# EasyEDA Pro project ODrive_v1.epro, schematic ODrive2_1

## Sheets
1 Motor: Board Name: ODrive2_1; Create Date: 2025-02-18; Page Name: Motor; Project Name: ODrive; Schematic Name: ODrive2_1; Update Date: 2025-02-18
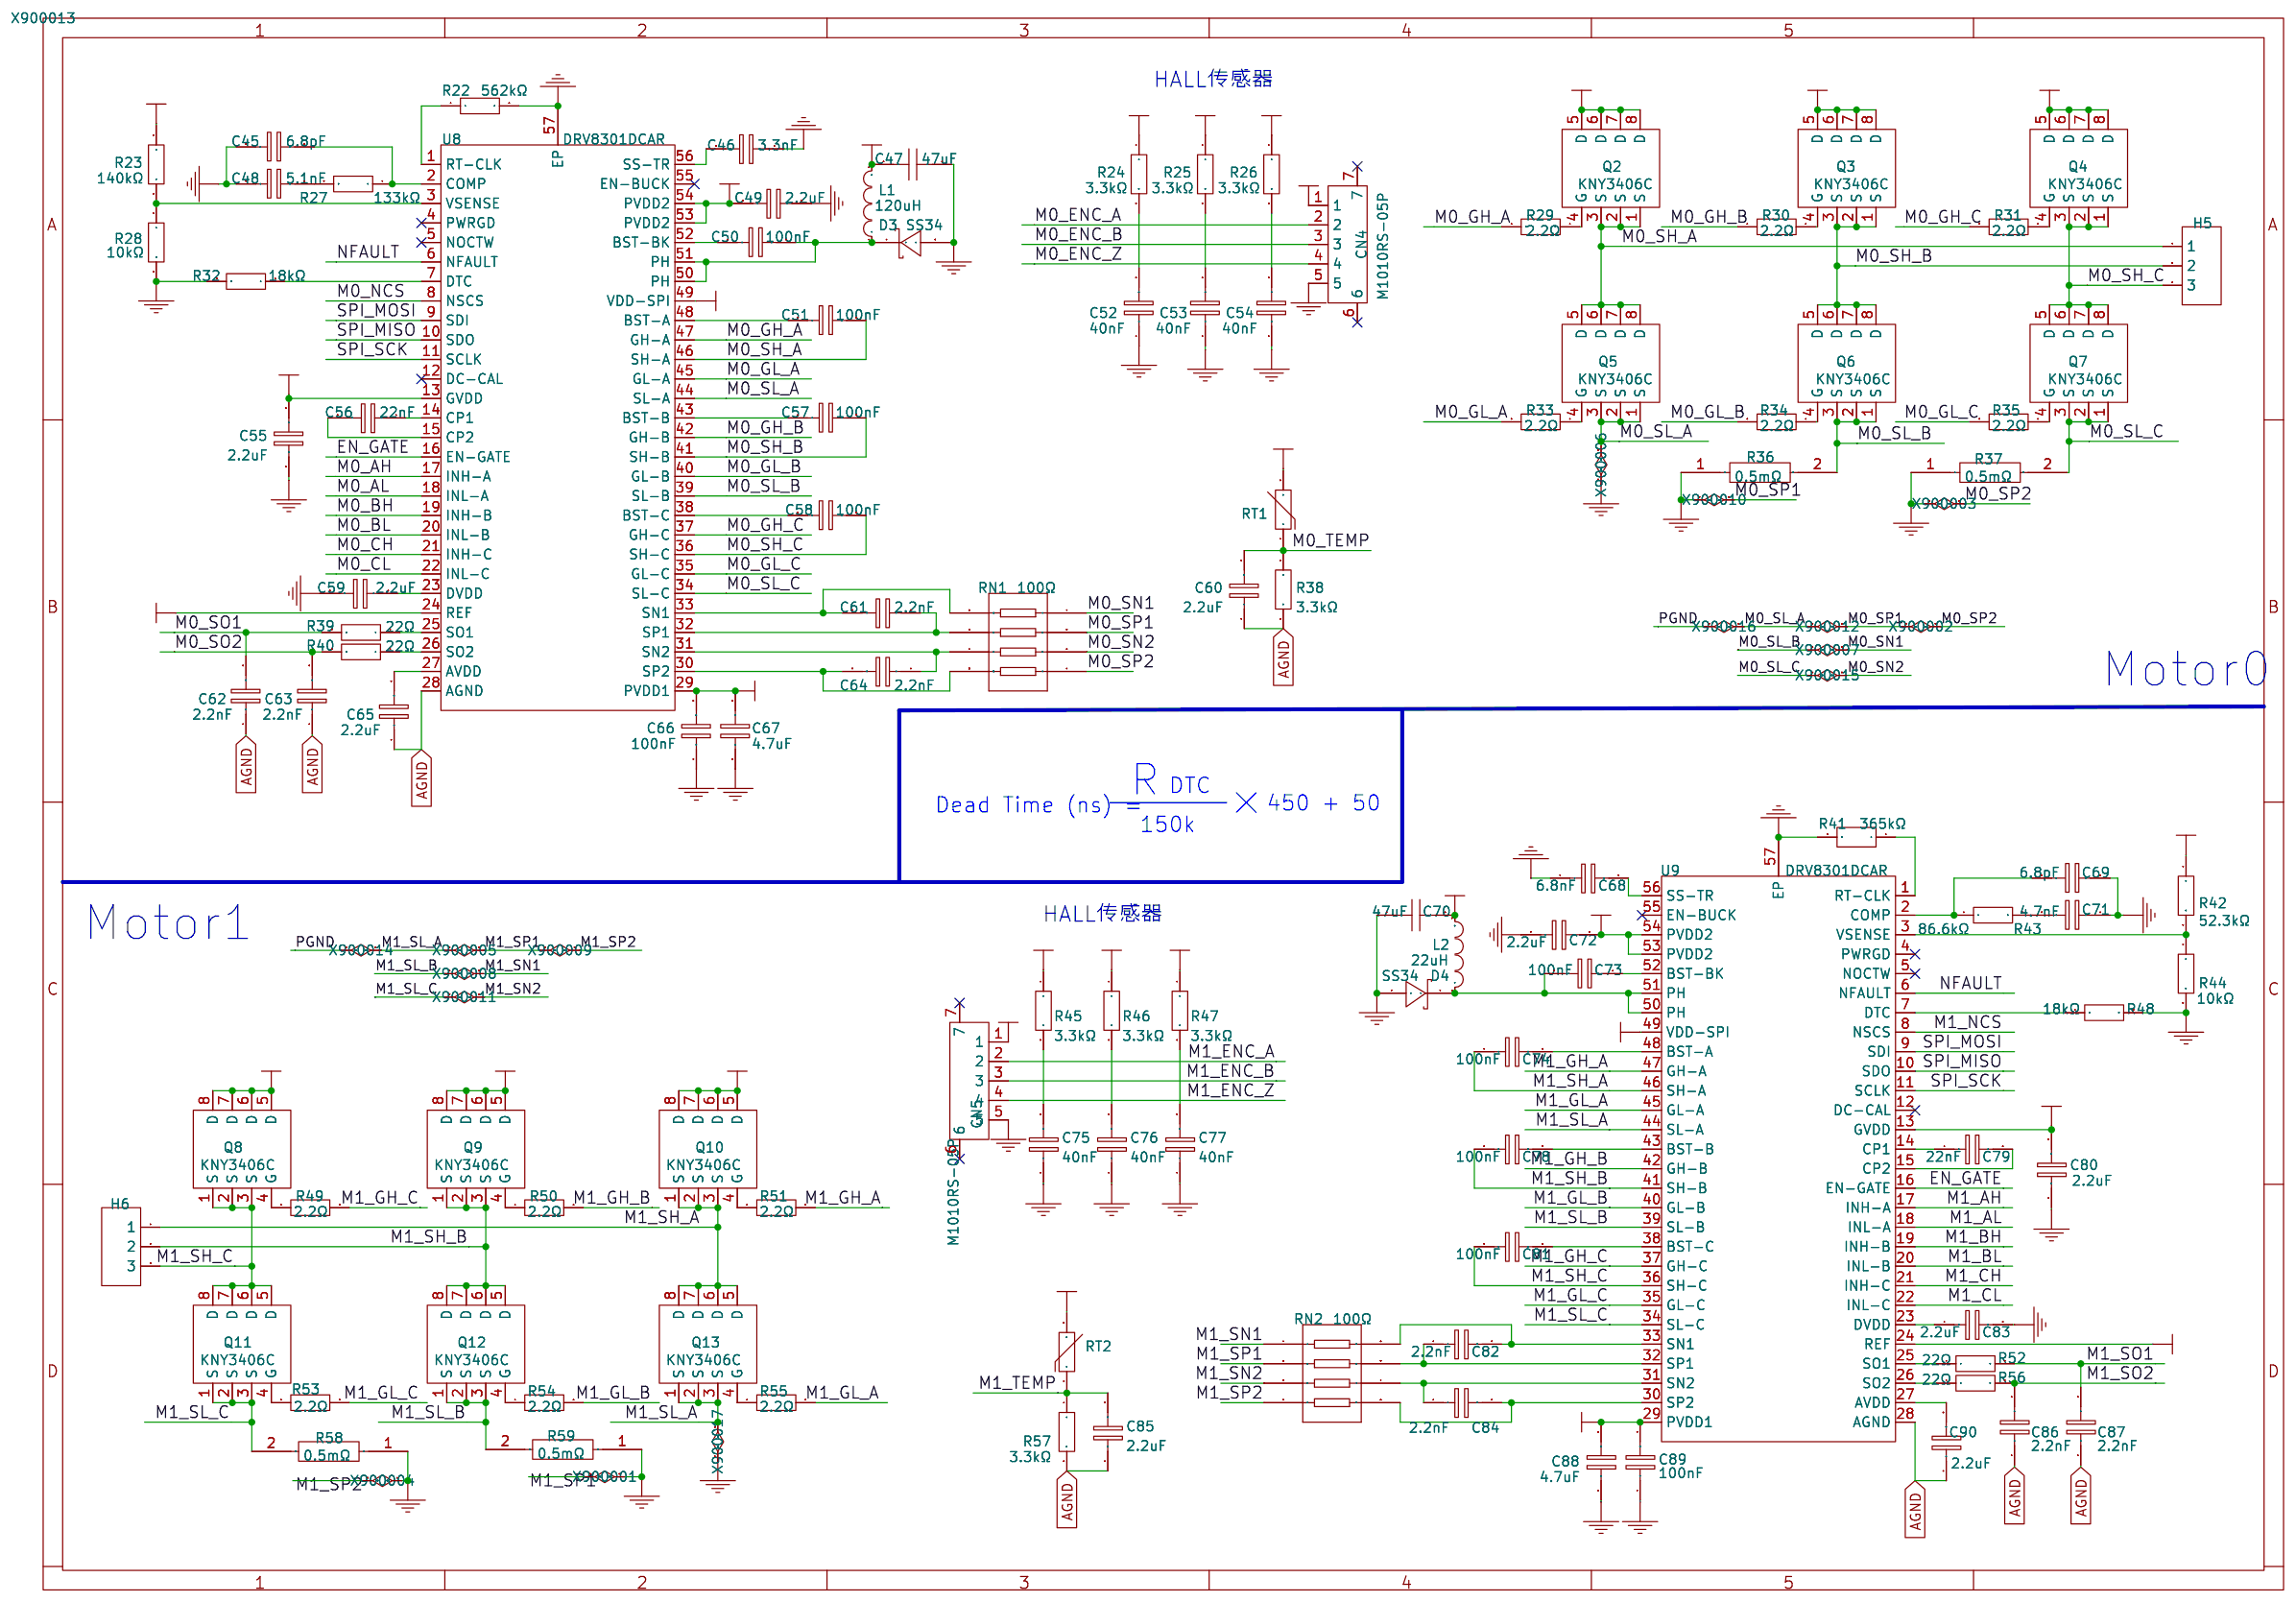
[diagram p5: Motor]
2 Controller: Page Name: Controller; Company: 嘉立创EDA; Page Size: A4; Version: V1.0
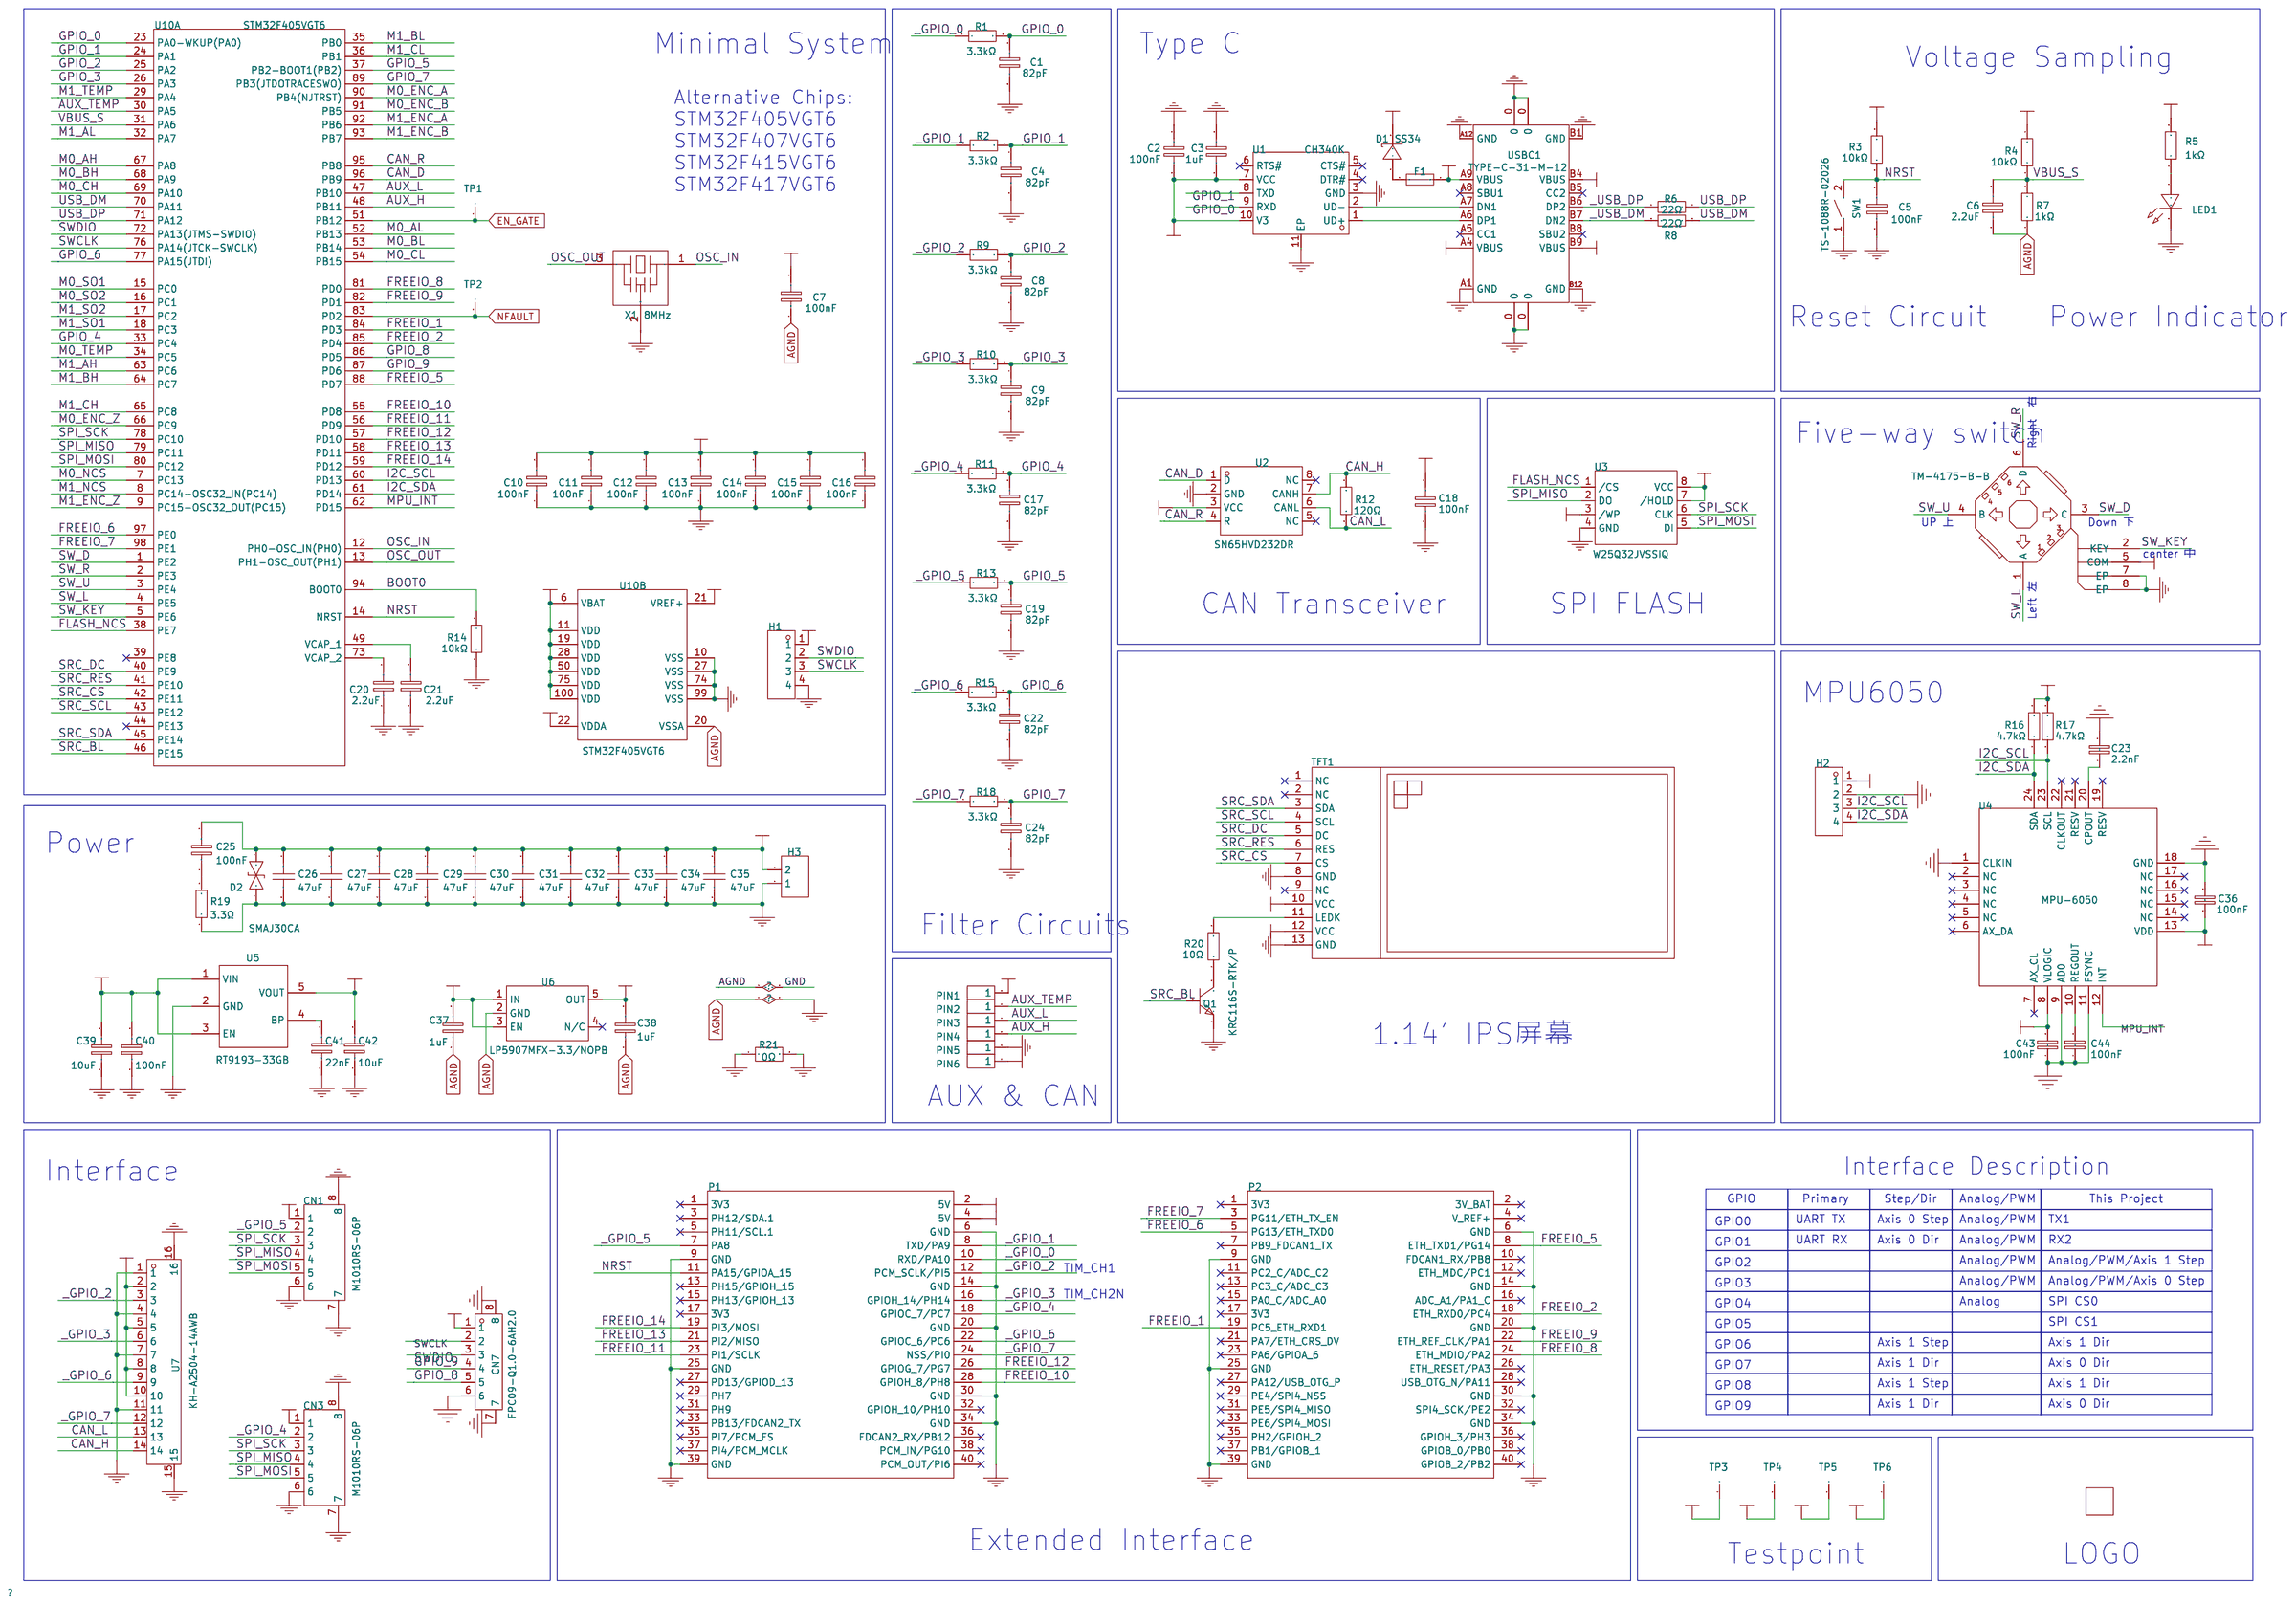
[diagram p6: Controller]

## Parts
sheet Controller
C1  82pF  [C0603]
C2  100nF  [C0603]
C3  1uF  [C0603]
C4  82pF  [C0603]
C5  100nF  [C0603]
C6  2.2uF  [C0603]
C7  100nF  [C0603]
C8  82pF  [C0603]
C9  82pF  [C0603]
C10  100nF  [C0603]
C11  100nF  [C0603]
C12  100nF  [C0603]
C13  100nF  [C0603]
C14  100nF  [C0603]
C15  100nF  [C0603]
C16  100nF  [C0603]
C17  82pF  [C0603]
C18  100nF  [C0603]
C19  82pF  [C0603]
C20  2.2uF  [C0603]
C21  2.2uF  [C0603]
C22  82pF  [C0603]
C23  2.2nF  [C0603]
C24  82pF  [C0603]
C25  100nF  [C0603]
C26  47uF  [C1812]
C27  47uF  [C1812]
C28  47uF  [C1812]
C29  47uF  [C1812]
C30  47uF  [C1812]
C31  47uF  [C1812]
C32  47uF  [C1812]
C33  47uF  [C1812]
C34  47uF  [C1812]
C35  47uF  [C1812]
C36  100nF  [C0603]
C37  1uF  [C0603]
C38  1uF  [C0603]
C39  10uF  [C0603]
C40  100nF  [C0603]
C41  22nF  [C0603]
C42  10uF  [C0603]
C43  100nF  [C0603]
C44  100nF  [C0603]
CN1  M1010RS-06P  [CONN-SMD_M1010RS-06P]
CN3  M1010RS-06P  [CONN-SMD_M1010RS-06P]
CN7  FPC09-Q1.0-6AH2.0  [FPC-SMD_6P-P1.00_XYECONN_FPC09-Q1.0-6AH2.0]
D1  SS34  [SMA_L4.4-W2.8-LS5.4-RD]
D2  SMAJ30CA  [SMA_L4.4-W2.6-LS5.0-BI]
F1  FSMD012-1206-R  [F1206]
H1  -  [HDR-TH_4P-P2.54-V-M]
H2  -  [HDR-TH_4P-P2.54-V-M]
H3  XT30U-M  [XT30U-M]
H4  MoonGrt  [MoonGrt]  (no BOM)
LED1  YLED0603B  [LED0603_BLUE]
P1  2.54-2*20P母  [MY_HDR-TH_40P-P2.54-V-M-R2-C20-S2.54]
P2  2.54-2*20P母  [MY_HDR-TH_40P-P2.54-V-M-R2-C20-S2.54]
PIN1  1PIN  [1PIN]  (no BOM)
PIN2  1PIN  [1PIN]  (no BOM)
PIN3  1PIN  [1PIN]  (no BOM)
PIN4  1PIN  [1PIN]  (no BOM)
PIN5  1PIN  [1PIN]  (no BOM)
PIN6  1PIN  [1PIN]  (no BOM)
Q1  KRC116S-RTK/P  [SOT-23-3_L2.9-W1.6-P1.90-LS2.8-BR]
R1  3.3kΩ  [R0603]
R2  3.3kΩ  [R0603]
R3  10kΩ  [R0603]
R4  10kΩ  [R0603]
R5  1kΩ  [R0603]
R6  22Ω  [R0603]
R7  1kΩ  [R0603]
R8  22Ω  [R0603]
R9  3.3kΩ  [R0603]
R10  3.3kΩ  [R0603]
R11  3.3kΩ  [R0603]
R12  120Ω  [R0603]
R13  3.3kΩ  [R0603]
R14  10kΩ  [R0603]
R15  3.3kΩ  [R0603]
R16  4.7kΩ  [R0603]
R17  4.7kΩ  [R0603]
R18  3.3kΩ  [R0603]
R19  3.3Ω  [R0603]
R20  10Ω  [R0603]
R21  0Ω  [R0603]
SW1  TS-1088R-02026  [SW-SMD_L3.9-W3.0-P4.45]
SW2  TM-4175-B-B  [SW-SMD_TM-4175-B-B]
TFT1  焊接式_TFT_1.14_135x240_13pin  [焊接式_TFT_1.14_135X240_13PIN]
TP1  Testpoint 1.6mm  [TESTPOINT 1.6MM]  (no BOM)
TP2  Testpoint 1.6mm  [TESTPOINT 1.6MM]  (no BOM)
TP3  Testpoint 1.6mm  [TESTPOINT 1.6MM]  (no BOM)
TP4  Testpoint 1.6mm  [TESTPOINT 1.6MM]  (no BOM)
TP5  Testpoint 1.6mm  [TESTPOINT 1.6MM]  (no BOM)
TP6  Testpoint 1.6mm  [TESTPOINT 1.6MM]  (no BOM)
U1  CH340K  [ESOP-10_L4.9-W3.9-P1.00-LS6.2-BL-EP]
U2  SN65HVD232DR  [SOIC-8_L5.0-W4.0-P1.27-LS6.0-BL]
U3  W25Q32JVSSIQ  [SOIC-8_L5.3-W5.3-P1.27-LS8.0-BL]
U4  MPU-6050  [QFN-24_L4.0-W4.0-P0.50-BL-EP2.7]
U5  RT9193-33GB  [SOT-23-5_L3.0-W1.7-P0.95-LS2.8-BR]
U6  LP5907MFX-3.3/NOPB  [SOT-23-5_L3.0-W1.7-P0.95-LS2.8-BR]
U7  KH-A2504-14AWB  [CONN-SMD_14P-P2.50_KH-A2504-14AWB]
U10  STM32F405VGT6  [LQFP-100_L14.0-W14.0-P0.50-LS16.0-BL]  (sections 1,2)
USBC1  TYPE-C-31-M-12  [USB-C_SMD-TYPE-C-31-M-12]
X1  8MHz  [OSC-SMD_3P-L3.2-W1.3-P1.20]
sheet Motor
C45  6.8pF  [C0603]
C46  3.3nF  [C0603]
C47  47uF  [C1812]
C48  5.1nF  [C0603]
C49  2.2uF  [C0603]
C50  100nF  [C0603]
C51  100nF  [C0603]
C52  40nF  [C0603]
C53  40nF  [C0603]
C54  40nF  [C0603]
C55  2.2uF  [C0603]
C56  22nF  [C0603]
C57  100nF  [C0603]
C58  100nF  [C0603]
C59  2.2uF  [C0603]
C60  2.2uF  [C0603]
C61  2.2nF  [C0603]
C62  2.2nF  [C0603]
C63  2.2nF  [C0603]
C64  2.2nF  [C0603]
C65  2.2uF  [C0603]
C66  100nF  [C0603]
C67  4.7uF  [C0603]
C68  6.8nF  [C0603]
C69  6.8pF  [C0603]
C70  47uF  [C1812]
C71  4.7nF  [C0603]
C72  2.2uF  [C0603]
C73  100nF  [C0603]
C74  100nF  [C0603]
C75  40nF  [C0603]
C76  40nF  [C0603]
C77  40nF  [C0603]
C78  100nF  [C0603]
C79  22nF  [C0603]
C80  2.2uF  [C0603]
C81  100nF  [C0603]
C82  2.2nF  [C0603]
C83  2.2uF  [C0603]
C84  2.2nF  [C0603]
C85  2.2uF  [C0603]
C86  2.2nF  [C0603]
C87  2.2nF  [C0603]
C88  4.7uF  [C0603]
C89  100nF  [C0603]
C90  2.2uF  [C0603]
CN4  M1010RS-05P  [CONN-SMD_M1010RS-05P]
CN5  M1010RS-05P  [CONN-SMD_M1010RS-05P]
D3  SS34  [SMA_L4.4-W2.8-LS5.4-RD]
D4  SS34  [SMA_L4.4-W2.8-LS5.4-RD]
H5  MR30-M  [MR30-M]
H6  MR30-M  [MR30-M]
L1  120uH  [IND-SMD_L6.0-W6.0]
L2  22uH  [IND-SMD_L6.0-W6.0]
Q2  KNY3406C  [PDFNWB-8L_L6.0-W5.0-P1.27-BL-EP_CON]
Q3  KNY3406C  [PDFNWB-8L_L6.0-W5.0-P1.27-BL-EP_CON]
Q4  KNY3406C  [PDFNWB-8L_L6.0-W5.0-P1.27-BL-EP_CON]
Q5  KNY3406C  [PDFNWB-8L_L6.0-W5.0-P1.27-BL-EP_CON]
Q6  KNY3406C  [PDFNWB-8L_L6.0-W5.0-P1.27-BL-EP_CON]
Q7  KNY3406C  [PDFNWB-8L_L6.0-W5.0-P1.27-BL-EP_CON]
Q8  KNY3406C  [PDFNWB-8L_L6.0-W5.0-P1.27-BL-EP_CON]
Q9  KNY3406C  [PDFNWB-8L_L6.0-W5.0-P1.27-BL-EP_CON]
Q10  KNY3406C  [PDFNWB-8L_L6.0-W5.0-P1.27-BL-EP_CON]
Q11  KNY3406C  [PDFNWB-8L_L6.0-W5.0-P1.27-BL-EP_CON]
Q12  KNY3406C  [PDFNWB-8L_L6.0-W5.0-P1.27-BL-EP_CON]
Q13  KNY3406C  [PDFNWB-8L_L6.0-W5.0-P1.27-BL-EP_CON]
R22  562kΩ  [R0603]
R23  140kΩ  [R0603]
R24  3.3kΩ  [R0603]
R25  3.3kΩ  [R0603]
R26  3.3kΩ  [R0603]
R27  133kΩ  [R0603]
R28  10kΩ  [R0603]
R29  2.2Ω  [R0603]
R30  2.2Ω  [R0603]
R31  2.2Ω  [R0603]
R32  18kΩ  [R0603]
R33  2.2Ω  [R0603]
R34  2.2Ω  [R0603]
R35  2.2Ω  [R0603]
R36  0.5mΩ  [R2512]
R37  0.5mΩ  [R2512]
R38  3.3kΩ  [R0603]
R39  22Ω  [R0603]
R40  22Ω  [R0603]
R41  365kΩ  [R0603]
R42  52.3kΩ  [R0603]
R43  86.6kΩ  [R0603]
R44  10kΩ  [R0603]
R45  3.3kΩ  [R0603]
R46  3.3kΩ  [R0603]
R47  3.3kΩ  [R0603]
R48  18kΩ  [R0603]
R49  2.2Ω  [R0603]
R50  2.2Ω  [R0603]
R51  2.2Ω  [R0603]
R52  22Ω  [R0603]
R53  2.2Ω  [R0603]
R54  2.2Ω  [R0603]
R55  2.2Ω  [R0603]
R56  22Ω  [R0603]
R57  3.3kΩ  [R0603]
R58  0.5mΩ  [R2512]
R59  0.5mΩ  [R2512]
RN1  100Ω  [RES-ARRAY-SMD_0603-8P-L3.2-W1.6-BL]
RN2  100Ω  [RES-ARRAY-SMD_0603-8P-L3.2-W1.6-BL]
RT1  NCP18XH103F03RB  [R0603]
RT2  NCP18XH103F03RB  [R0603]
U8  DRV8301DCAR  [HTSSOP-56_L14.0-W6.0-P0.50-LS8.0-BL]
U9  DRV8301DCAR  [HTSSOP-56_L14.0-W6.0-P0.50-LS8.0-BL]

## Library data of the parts
C1 C4 C8 C9 C17 C19 C22 C24 = 0603CG820J500NT: 容值:82pF;精度:±5%;额定电压:50V;材质(温度系数):C0G;; LCSC Part Name: 82pF ±5% 50V; Supplier Part: C1683; Manufacturer: FH(风华); Supplier Footprint: 0603; JLCPCB Part Class: Extended Part; Datasheet: https://atta.szlcsc.com/upload/public/pdf/source/20200305/C486355_26A10D38EF8C2A5C37091D0039909270.pdf; Supplier: LCSC; Tolerance: ±5%; Voltage Rated: 50V; Temperature Coefficient: C0G
C2 C5 C7 C10-C16 C18 C25 C36 C40 C43 C44 C50 C51 C57 C58 C66 C73 C74 C78 C81 C89 = CC0603KRX7R9BB104: 容值:100nF;精度:±10%;额定电压:50V;材质(温度系数):X7R;; LCSC Part Name: 100nF ±10% 50V; Supplier Part: C14663; Manufacturer: YAGEO(国巨); Supplier Footprint: 0603; JLCPCB Part Class: Basic Part; Datasheet: https://atta.szlcsc.com/upload/public/pdf/source/20180910/C282072_33301C7F631E79921B82A8DAC6BCC5B3.pdf; Supplier: LCSC; Tolerance: ±10%; Voltage Rated: 50V; Temperature Coefficient: X7R
C3 C37 C38 = CL10A105KO8NNNC: 容值:1uF;精度:±10%;额定电压:16V;材质(温度系数):X5R;; LCSC Part Name: 1uF ±10% 16V; Supplier Part: C1592; Manufacturer: SAMSUNG(三星); Supplier Footprint: 0603; JLCPCB Part Class: Extended Part; Datasheet: https://atta.szlcsc.com/upload/public/pdf/source/20220919/9FBE606BE0D9532D730F292EB26DC5BB.pdf; Supplier: LCSC; Tolerance: ±10%; Voltage Rated: 16V; Temperature Coefficient: X5R
C6 C20 C21 C49 C55 C59 C60 C65 C72 C80 C83 C85 C90 = GRM188R61H225KE11D: 容值:2.2uF;精度:±10%;额定电压:50V;材质(温度系数):X5R;; LCSC Part Name: 2.2uF ±10% 50V; Supplier Part: C162273; Manufacturer: muRata(村田); Supplier Footprint: 0603; JLCPCB Part Class: Extended Part; Datasheet: https://atta.szlcsc.com/upload/public/pdf/source/20181211/C162273_A9C6FF7829784AEF50225F4680DD9126.pdf; Supplier: LCSC; Tolerance: ±10%; Voltage Rated: 50V; Temperature Coefficient: X5R
C23 C61-C64 C82 C84 C86 C87 = 0603B222K500NT: 容值:2.2nF;精度:±10%;额定电压:50V;材质(温度系数):X7R;; LCSC Part Name: 2.2nF ±10% 50V; Supplier Part: C1604; Manufacturer: FH(风华); Supplier Footprint: 0603; JLCPCB Part Class: Basic Part; Datasheet: https://atta.szlcsc.com/upload/public/pdf/source/20200305/C486355_26A10D38EF8C2A5C37091D0039909270.pdf; Supplier: LCSC; Tolerance: ±10%; Voltage Rated: 50V; Temperature Coefficient: X7R
C26-C35 C47 C70 = C4532X5R1A476MT000N: 容值:47uF;精度:±20%;额定电压:10V;材质(温度系数):X5R;; LCSC Part Name: 47uF ±20% 10V; Supplier Part: C342615; Manufacturer: TDK; Supplier Footprint: 1812; JLCPCB Part Class: Extended Part; Datasheet: https://atta.szlcsc.com/upload/public/pdf/source/20190612/C361180_85CC9FB0751BEA97238DE56AB4AF0B1F.pdf; Supplier: LCSC; Tolerance: ±20%; Voltage Rated: 10V; Temperature Coefficient: X5R
C39 C42 = CL10A106MP8NNNC: 容值:10uF;精度:±20%;额定电压:10V;材质(温度系数):X5R;; LCSC Part Name: 10uF ±20% 10V; Supplier Part: C85713; Manufacturer: SAMSUNG(三星); Supplier Footprint: 0603; JLCPCB Part Class: Extended Part; Datasheet: https://atta.szlcsc.com/upload/public/pdf/source/20160218/1457707763339.pdf; Supplier: LCSC; Tolerance: ±20%; Voltage Rated: 10V; Temperature Coefficient: X5R
C41 C56 C79 = CL10B223KB8NNNC: 容值:22nF;精度:±10%;额定电压:50V;材质(温度系数):X7R;; LCSC Part Name: 22nF ±10% 50V; Supplier Part: C21122; Manufacturer: SAMSUNG(三星); Supplier Footprint: 0603; JLCPCB Part Class: Basic Part; Datasheet: https://atta.szlcsc.com/upload/public/pdf/source/20160218/1457707763339.pdf; Supplier: LCSC; Tolerance: ±10%; Voltage Rated: 50V; Temperature Coefficient: X7R
CN1 CN3 = M1010RS-06P: 插针结构:1x6P;间距:1mm;安装方式:卧贴;参考系列:-;总PIN数:6P;排数:1;每排PIN数:6;行距:-;额定电流:1A;工作温度范围:-25℃~+85℃;; LCSC Part Name: 1x6P 间距:1mm 卧贴; Supplier Part: C541848; Manufacturer: XFCN(兴飞); Supplier Footprint: SMD,P=1mm,卧贴; JLCPCB Part Class: Extended Part; Datasheet: https://atta.szlcsc.com/upload/public/pdf/source/20200518/C541847_4FBBB7CE1CCFE042AF6DD43CBAA42E89.pdf; Supplier: LCSC; Pins Structure: 1x6P; Pitch: 1mm; Mounting Style: 卧贴; Number of Pins: 6P; Number of Rows: 1; Number of PINs Per Row: 6; Current Rating (Max): 1A; Operating Temperature Range: -25℃~+85℃
CN7 = FPC09-Q1.0-6AH2.0: 锁定特性:翻盖式;触点类型:下接;触点数量:6P;间距:1mm;安装类型:卧贴;; LCSC Part Name: 间距:1mm P数:6P 翻盖式 下接; Supplier Part: C19269921; Manufacturer: XYECONN(辛译); Supplier Footprint: SMD,P=1mm,卧贴; JLCPCB Part Class: Extended Part; Datasheet: https://atta.szlcsc.com/upload/public/pdf/source/20231122/290E50ABEF878A57FE1C34FD27D651A8.pdf; Supplier: LCSC; Locking Feature: 翻盖式; Contact Type: 下接; Number of Contacts: 6P; Pitch: 1mm; Mounting Type: 卧贴; Height Above Board: 2mm
D1 D3 D4 = SS34_C142458: 正向压降(Vf):500mV@3A;直流反向耐压(Vr):40V;平均整流电流(Io):3A;; LCSC Part Name: 电压:40V 电流:3A; Supplier Part: C142458; Supplier Footprint: SMA(DO-214AC); JLCPCB Part Class: Extended Part; Datasheet: https://atta.szlcsc.com/upload/public/pdf/source/20171114/C142458_15106326937931117548.pdf; Supplier: LCSC; Forward Voltage (Vf@If): 500mV@3A; Reverse Voltage (Vr): 40V; Average Rectified Current (Io): 3A
D2 = SMAJ30CA_C266339: 反向截止电压(Vrwm):30V;最大钳位电压:48.4V;峰值脉冲电流(Ipp):8.3A;峰值脉冲功率(Ppp):400W;击穿电压:33.3V;; LCSC Part Name: 双向TVS 30V截止 8.3A峰值脉冲; Supplier Part: C266339; Manufacturer: GOOD-ARK(固锝); Supplier Footprint: SMA(DO-214AC); JLCPCB Part Class: Extended Part; Datasheet: https://atta.szlcsc.com/upload/public/pdf/source/20181218/C266339_E2F84BC65B90D6C192327DA52037B2A6.pdf; Supplier: LCSC; Reverse Stand-Off Voltage (Vrwm): 30V; Maximum Clamping Voltage: 48.4V; Peak Pulse Current (Ipp): 8.3A; Peak Pulse Power Dissipation (Ppp): 400W; Breakdown Voltage: 33.3V; Reverse Leakage Current (Ir): 1uA; Type: TVS
F1 = FSMD012-1206-R: 最大电压:48V;最大电流:100A;保持电流:120mA;跳闸电流:390mA;; LCSC Part Name: 48V 120mA 1206自恢复; Supplier Part: C220144; Manufacturer: FUZETEC(富致); Supplier Footprint: 1206; JLCPCB Part Class: Extended Part; Datasheet: https://atta.szlcsc.com/upload/public/pdf/source/20180530/C220148_049DD1B3B45E5B13B513EB60E97CECB8.pdf; Supplier: LCSC; Operating Voltage (Max): 48V; Current Rating (Max): 100A; Hold Current: 120mA; Trip Current: 390mA
H1 H2 = PZ254V-11-04P: Supplier Part: C2691448
H3 = XT30U-M: Supplier Part: C99101; Supplier: LCSC; Manufacturer: AMASS(艾迈斯)
H4 = MoonGrt
LED1 = YLED0603B: 发光颜色:蓝色;正向电压(VF):2.6V~3.2V;功率:-;正向电流:30mA;主波长:460nm~475nm;发光角度:120°;工作温度:-40℃~+85℃;; Supplier Part: C19171394; Manufacturer: YONGYUTAI(永裕泰); Supplier Footprint: 0603; JLCPCB Part Class: Extended Part; Datasheet: https://atta.szlcsc.com/upload/public/pdf/source/20231027/6134FF4BA718E32A802654BBC76F69A6.pdf; Supplier: LCSC; Emitted Color: 蓝色; Forward Voltage (VF): 2.6V~3.2V; Forward Current: 30mA; Dominant Wavelength: 460nm~475nm; Viewing Angle: 120°; Operating Temperature: -40℃~+85℃
P1 P2 = 2.54-2*20P母: 插孔结构:2x20P;间距:2.54mm;行距:2.54mm;安装类型:直插;排数:双排;总孔位数:40P;塑高:-;触头材质:黄铜;触头镀层:-;; LCSC Part Name: 间距:2.54mm 2x20P 直插; Supplier Part: C50982; Manufacturer: BOOMELE(博穆精密); Supplier Footprint: 插件,P=2.54mm; JLCPCB Part Class: Extended Part; Supplier: LCSC; Holes Structure: 2x20P; Pitch: 2.54mm; Row Spacing: 2.54mm; Mounting Type: 直插; Number of Rows: 双排; Number of Holes: 40P; Contact Material: 黄铜
PIN1-PIN6 = 1PIN
Q1 = KRC116S-RTK/P: 晶体管类型:-;集射极击穿电压(Vceo):50V;集电极电流(Ic):100mA;功率(Pd):200mW;; LCSC Part Name: 耐压:50V 电流:100mA; Supplier Part: C125283; Manufacturer: KEC; Supplier Footprint: SOT-23; JLCPCB Part Class: Extended Part; Datasheet: https://atta.szlcsc.com/upload/public/pdf/source/20170814/C125285_1502678179881885598.pdf; Supplier: LCSC; Collector-Emitter Breakdown Voltage (Vceo): 50V; Collector Current (Ic): 100mA; Power Dissipation (Pd): 200mW
R1 R2 R9-R11 R13 R15 R18 R24-R26 R38 R45-R47 R57 = 0603WAF3301T5E: 电阻类型:厚膜电阻;阻值:3.3kΩ;精度:±1%;功率:100mW;最大工作电压:75V;温度系数:±100ppm/℃;; LCSC Part Name: 3.3kΩ ±1% 100mW 厚膜电阻; Supplier Part: C22978; Manufacturer: UNI-ROYAL(厚声); Supplier Footprint: 0603; JLCPCB Part Class: Basic Part; Datasheet: https://atta.szlcsc.com/upload/public/pdf/source/20200306/C422600_1E6D84923E4A46A82E41ADD87F860B5C.pdf; Supplier: LCSC; Type: 厚膜电阻; Tolerance: ±1%; Power(Watts): 100mW; Overload Voltage (Max): 75V; Temperature Coefficient: ±100ppm/℃; Operating Temperature Range: -55℃~+155℃
R3 R4 R14 R28 R44 = RC0603FR-0710KL: 电阻类型:厚膜电阻;阻值:10kΩ;精度:±1%;功率:100mW;最大工作电压:75V;温度系数:±100ppm/℃;; LCSC Part Name: 厚膜电阻 10kΩ ±1% 100mW; Supplier Part: C98220; Manufacturer: YAGEO(国巨); Supplier Footprint: 0603; JLCPCB Part Class: Extended Part; Datasheet: https://atta.szlcsc.com/upload/public/pdf/source/20180927/C295883_E8D83085EA81BD7DE0B2B681138C15EE.pdf; Supplier: LCSC; Type: 厚膜电阻; Tolerance: ±1%; Power(Watts): 100mW; Overload Voltage (Max): 75V; Temperature Coefficient: ±100ppm/℃; Operating Temperature Range: -55℃~+155℃
R5 R7 = RT0603FRE071KL: 电阻类型:薄膜电阻;阻值:1kΩ;精度:±1%;功率:100mW;最大工作电压:75V;温度系数:±50ppm/℃;; LCSC Part Name: 薄膜电阻 1kΩ ±1% 100mW; Supplier Part: C375503; Manufacturer: YAGEO(国巨); Supplier Footprint: 0603; JLCPCB Part Class: Extended Part; Datasheet: https://atta.szlcsc.com/upload/public/pdf/source/20190227/C375503_9EB26A65C07F9B8645B441605E668894.pdf; Supplier: LCSC; Type: 薄膜电阻; Tolerance: ±1%; Power(Watts): 100mW; Overload Voltage (Max): 75V; Temperature Coefficient: ±50ppm/℃; Operating Temperature Range: -55℃~+155℃
R6 R8 R39 R40 R52 R56 = ARG03FTC0220: 电阻类型:薄膜电阻;阻值:22Ω;精度:±1%;功率:100mW;最大工作电压:75V;温度系数:±25ppm/℃;; LCSC Part Name: 薄膜电阻 22Ω ±1% 100mW; Supplier Part: C217888; Manufacturer: Viking(光颉); Supplier Footprint: 0603; JLCPCB Part Class: Extended Part; Datasheet: https://atta.szlcsc.com/upload/public/pdf/source/20200117/C485675_99063924B4564AF910B7BE66DA8EFA49.pdf; Supplier: LCSC; Type: 薄膜电阻; Tolerance: ±1%; Power(Watts): 100mW; Overload Voltage (Max): 75V; Temperature Coefficient: ±25ppm/℃; Operating Temperature Range: -55℃~+155℃
R12 = HPCR0603F120RK9: 电阻类型:厚膜电阻;阻值:120Ω;精度:±1%;功率:-;最大工作电压:50V;温度系数:±100ppm/℃;; LCSC Part Name: 厚膜电阻 120Ω ±1%; Supplier Part: C365072; Manufacturer: RESI(开步睿思); Supplier Footprint: 0603; JLCPCB Part Class: Extended Part; Datasheet: https://atta.szlcsc.com/upload/public/pdf/source/20200302/C492020_A67DFE56E3A0098A28FA0495227278A6.pdf; Supplier: LCSC; Type: 厚膜电阻; Tolerance: ±1%; Overload Voltage (Max): 50V; Temperature Coefficient: ±100ppm/℃; Operating Temperature Range: -55℃~+125℃
R16 R17 = 0603WAF4701T5E: 电阻类型:厚膜电阻;阻值:4.7kΩ;精度:±1%;功率:100mW;最大工作电压:75V;温度系数:±100ppm/℃;; LCSC Part Name: 4.7kΩ ±1% 100mW 厚膜电阻; Supplier Part: C23162; Manufacturer: UNI-ROYAL(厚声); Supplier Footprint: 0603; JLCPCB Part Class: Basic Part; Datasheet: https://atta.szlcsc.com/upload/public/pdf/source/20200306/C422600_1E6D84923E4A46A82E41ADD87F860B5C.pdf; Supplier: LCSC; Type: 厚膜电阻; Tolerance: ±1%; Power(Watts): 100mW; Overload Voltage (Max): 75V; Temperature Coefficient: ±100ppm/℃; Operating Temperature Range: -55℃~+155℃
R19 = 0603WAF330KT5E: 电阻类型:厚膜电阻;阻值:3.3Ω;精度:±1%;功率:100mW;最大工作电压:75V;温度系数:±400ppm/℃;; LCSC Part Name: 3.3Ω ±1% 100mW 厚膜电阻; Supplier Part: C22979; Manufacturer: UNI-ROYAL(厚声); Supplier Footprint: 0603; JLCPCB Part Class: Extended Part; Datasheet: https://atta.szlcsc.com/upload/public/pdf/source/20200306/C422600_1E6D84923E4A46A82E41ADD87F860B5C.pdf; Supplier: LCSC; Type: 厚膜电阻; Tolerance: ±1%; Power(Watts): 100mW; Overload Voltage (Max): 75V; Temperature Coefficient: ±400ppm/℃; Operating Temperature Range: -55℃~+155℃
R20 = QR0603J10R0P05Z: 电阻类型:厚膜电阻;阻值:10Ω;精度:±5%;功率:100mW;最大工作电压:75V;温度系数:±100ppm/℃;; LCSC Part Name: 厚膜电阻 10Ω ±5% 100mW; Supplier Part: C176153; Manufacturer: EVER OHMS(天二科技); Supplier Footprint: 0603; JLCPCB Part Class: Extended Part; Datasheet: https://atta.szlcsc.com/upload/public/pdf/source/20190816/C191725_FB5BDDD87CE7DE7F0F741FE894220CBC.pdf; Supplier: LCSC; Type: 厚膜电阻; Tolerance: ±5%; Power(Watts): 100mW; Overload Voltage (Max): 75V; Temperature Coefficient: ±100ppm/℃; Operating Temperature Range: -55℃~+155℃
R21 = 0603WAJ0000T5E: 电阻类型:厚膜电阻;阻值:0Ω;精度:±5%;功率:100mW;最大工作电压:75V;温度系数:±800ppm/℃;; LCSC Part Name: 0Ω ±5% 100mW 厚膜电阻; Supplier Part: C15402; Manufacturer: UNI-ROYAL(厚声); Supplier Footprint: 0603; JLCPCB Part Class: Extended Part; Datasheet: https://atta.szlcsc.com/upload/public/pdf/source/20200306/C422600_1E6D84923E4A46A82E41ADD87F860B5C.pdf; Supplier: LCSC; Type: 厚膜电阻; Tolerance: ±5%; Power(Watts): 100mW; Overload Voltage (Max): 75V; Temperature Coefficient: ±800ppm/℃; Operating Temperature Range: -55℃~+155℃
SW1 = TS-1088R-02026: 电路结构:单刀单掷;按钮形状:圆形按钮;安装方式:立贴;开关长度:3.9mm;开关宽度:2.93mm;开关高度:2mm;触点电流:50mA;额定电压(DC):12V;带灯:-;机械寿命:-;; LCSC Part Name: 3.9*2.93*2mm 立贴 轻触开关; Supplier Part: C455280; Manufacturer: XUNPU(讯普); Supplier Footprint: SMD,3x4mm; JLCPCB Part Class: Extended Part; Datasheet: https://atta.szlcsc.com/upload/public/pdf/source/20191118/C455281_EC5379764BC1462550DF64BBBFEA9579.pdf; Supplier: LCSC; Circuit: 单刀单掷; Actuator Style: 圆形按钮; Mounting Style: 立贴; Switch Length: 3.9mm; Switch Width: 2.93mm; Switch Height: 2mm; Contact Current: 50mA; Voltage Rating (DC): 12V
SW2 = TM-4175-B-B: 7.5*7.5*6五向开关 H6 升级减少摇晃 显示器五向开关; LCSC Part Name: 7.5*7.5*6五向开关 H6 升级减少摇晃 显示器五向开关; Supplier Part: C465996; Manufacturer: XKB Connection(中国星坤); Supplier Footprint: SMD-8P,7.5x7.5mm; JLCPCB Part Class: Extended Part; Datasheet: https://atta.szlcsc.com/upload/public/pdf/source/20211011/A0F6117F2AB0E02F6CF3847B7456F266.pdf; Supplier: LCSC
TFT1 = 焊接式_TFT_1.14_135x240_13pin
TP1-TP6 = Testpoint 1.6mm
U1 = CH340K: 应用功能:USB转串口;接口协议:USB 2.0;通道数:-;数据速率:2Mbps;; LCSC Part Name: USB转串口芯片CH340; Supplier Part: C968586; Manufacturer: WCH(南京沁恒); Supplier Footprint: ESSOP-10-150mil-1mm; JLCPCB Part Class: Extended Part; Datasheet: https://atta.szlcsc.com/upload/public/pdf/source/20240313/C21A12AB66F63ABF8F8743FF13A35C95.pdf; Supplier: LCSC; Applications Function: USB转串口; Protocol: USB 2.0; Supply Voltage: 3.3V；5V; Data Rate: 2Mbps; Operating Temperature: -20℃~+70℃
U2 = SN65HVD232DR: 类型:CAN收发器;数据速率:1Mbps;; LCSC Part Name: 3.3-V CAN 收发器; Supplier Part: C30530; Manufacturer: TI(德州仪器); Supplier Footprint: SOIC-8; JLCPCB Part Class: Extended Part; Datasheet: https://www.ti.com/cn/lit/gpn/sn65hvd230; Supplier: LCSC; Type: CAN收发器; Data Rate: 1Mbps; Supply Voltage: 3.6V~7.5V; Supply Current: 370uA; Operating Temperature: -40℃~+85℃; JLCPCB SMD: Yes; image: //image.lceda.cn/szlcsc/C30530.jpg
U3 = W25Q32JVSSIQ_C82344: 接口类型:SPI;存储容量:32Mbit;时钟频率(fc):133MHz;; Supplier Part: C82344; Manufacturer: WINBOND(华邦); Supplier Footprint: SOIC-8-208mil; JLCPCB Part Class: Extended Part; Datasheet: https://atta.szlcsc.com/upload/public/pdf/source/20160910/1473490310454.pdf; Supplier: LCSC; Interface Type: SPI; Memory Size: 32Mbit; Supply Voltage: 2.7V~3.6V; Page Programming Time (Tpp): 3ms; Operating Temperature: -40℃~+85℃; Interface: SPI; Clock Frequency: 133MHz; Voltage - Supply: 2.7V~3.6V; Block Erase Time(tBE): 120ms@(32KB); Data Retention - TDR (Year): 20年
U4 = MPU-6050: 传感器类型:加速度计陀螺仪;; Supplier Part: C24112; Manufacturer: TDK InvenSense(应美盛); Supplier Footprint: QFN-24-EP(4x4); JLCPCB Part Class: Extended Part; Datasheet: https://atta.szlcsc.com/upload/public/pdf/source/20140425/1457707046159.pdf; Supplier: LCSC; Sensor Type: 加速度计陀螺仪; Operating Temperature: -40℃~+85℃; Design Item ID: MPU6050; Library Name: fly
U5 = RT9193-33GB: 输出类型:固定;最大输入电压:5.5V;输出电压:3.3V;输出电流:300mA;电源纹波抑制比(PSRR):70dB@(100Hz)；50dB@(10kHz);输出极性:正极;; LCSC Part Name: 输入5.5V 输出3.3V 300mA; Supplier Part: C15651; Manufacturer: RICHTEK(立锜); Supplier Footprint: SOT-23-5; JLCPCB Part Class: Extended Part; Datasheet: https://atta.szlcsc.com/upload/public/pdf/source/20130730/1457706628575.pdf; Supplier: LCSC; Output Type: 固定; Maximum Input Voltage: 5.5V; Output Voltage: 3.3V; Output Current: 300mA; Power Supply Rejection Ratio (PSRR): 70dB@(100Hz)；50dB@(10kHz); Dropout Voltage: 300mV@(300mA); standby current: 130uA; Feature: 防静电保护；低ESR；热保护(TSD)；过流保护(OCP)；带使能; Operating Temperature: -40℃~+125℃; Output Polarity: 正极; Number of Outputs: 1
U6 = LP5907MFX-3.3/NOPB: 输出类型:固定;最大输入电压:5.5V;输出电压:3.3V;输出电流:250mA;电源纹波抑制比(PSRR):90dB@(100Hz)；60dB@(100kHz);输出极性:正极;; LCSC Part Name: 具有低 IQ 和使能功能的 250mA、低噪声、高 PSRR、超低压降稳压器; Supplier Part: C80670; Manufacturer: TI(德州仪器); Supplier Footprint: SOT-23-5; JLCPCB Part Class: Extended Part; Datasheet: https://www.ti.com/cn/lit/gpn/lp5907; Supplier: LCSC; Output Type: 固定; Maximum Input Voltage: 5.5V; Output Voltage: 3.3V; Output Current: 250mA; Power Supply Rejection Ratio (PSRR): 90dB@(100Hz)；60dB@(100kHz); Dropout Voltage: 250mV@(250mA); standby current: 25uA; Feature: 防静电保护；短路保护；自动放电功能；低ESR；热保护(TSD)；欠压闭锁；带使能; Operating Temperature: -40℃~+125℃; Output Polarity: 正极; Number of Outputs: 1; JLCPCB SMD: Yes
U7 = KH-A2504-14AWB: 插针结构:1x14P;间距:2.54mm;安装方式:卧贴;总PIN数:14P;排数:1;每排PIN数:14;; LCSC Part Name: 1x14P 间距:2.54mm 卧贴; Supplier Part: C18186439; Manufacturer: kinghelm(金航标); Supplier Footprint: SMD,P=2.5mm; JLCPCB Part Class: 扩展库; Datasheet: https://atta.szlcsc.com/upload/public/pdf/source/20230919/B022AC6E9CF28BF3304DC62865C18B8A.pdf; Supplier: LCSC; Pins Structure: 1x14P; Pitch: 2.54mm; Mounting Style: 卧贴; Number of Pins: 14P; Number of Rows: 1; Number of PINs Per Row: 14
U10 = STM32F405VGT6: CPU内核:ARM-M4;程序存储容量:1MB;RAM总容量:192KB;GPIO端口数量:82;工作电压范围:1.8V~3.6V;CPU最大主频:168MHz;程序存储器类型:FLASH;; LCSC Part Name: 带DSP和FPU的高性能基础系列ARM Cortex-M4 MCU，具有1 MB Flash、168 MHz CPU、ART加速器和FSMC; Supplier Part: C56621; Manufacturer: ST(意法半导体); Supplier Footprint: LQFP-100(14x14); JLCPCB Part Class: 扩展库; Datasheet: https://atta.szlcsc.com/upload/public/pdf/source/20150910/1457707351424.pdf; Supplier: LCSC; CPU Core: ARM-M4; Program Storage Size: 1MB; RAM Size: 192KB; GPIO Ports Number: 82; Operating Voltage Range: 1.8V~3.6V; CPU Maximum Speed: 168MHz; Program Memory Type: FLASH; Operating Temperature Range: -40℃~+85℃; ADC (Bit): 12bit; DAC (Bit): 12bit; Universal Serial Bus: 有; Peripheral/Function: DMA；LCD/LED驱动；PWM; Watchdog: 有; Infrared Data Association: 有; Low-Voltage Detect: 有; LCD Module: 有; Direct Memory Access: 有; Internal Oscillator: 有
USBC1 = TYPE-C-31-M-12: 连接器类型:Type-C;标准:-;公母:母;安装方式:-;触点数量:16P;端口数量:1;额定电流 - 电源:5A;工作温度范围:-;; LCSC Part Name: Type-C 母; Supplier Part: C165948; Manufacturer: 韩国韩荣; Supplier Footprint: SMD; JLCPCB Part Class: Extended Part; Datasheet: https://atta.szlcsc.com/upload/public/pdf/source/20220525/466408E853115E789EDB0DDC29077C05.pdf; Supplier: LCSC; Connector Type: Type-C; Gender: 母; Number of Contacts: 16P; Number of Ports: 1; Current Rating - Power (Max): 5A
X1 = CSTNE8M00G520000R0: 频率:8MHz;内置负载电容:10pF;谐振阻抗:40Ω;; LCSC Part Name: 8MHz ±0.5% 内置负载电容:10pF; Supplier Part: C907975; Manufacturer: muRata(村田); Supplier Footprint: SMD3213-3P; JLCPCB Part Class: Extended Part; Datasheet: https://atta.szlcsc.com/upload/public/pdf/source/20201022/C907975_BE77A173E35C03920A12013DDB2B8858.pdf; Supplier: LCSC; Built-in Load Capacitance: 10pF; Resonant Impedance: 40Ω; Operating Temperature: -40℃~+85℃
C45 C69 = 0603CG6R8C500NT: 容值:6.8pF;额定电压:50V;材质(温度系数):C0G;; LCSC Part Name: 6.8pF 50V; Supplier Part: C1679; Manufacturer: FH(风华); Supplier Footprint: 0603; JLCPCB Part Class: Extended Part; Datasheet: https://atta.szlcsc.com/upload/public/pdf/source/20200305/C486355_26A10D38EF8C2A5C37091D0039909270.pdf; Supplier: LCSC; Voltage Rated: 50V; Temperature Coefficient: C0G
C46 = 0603B332K500NT: 容值:3.3nF;精度:±10%;额定电压:50V;材质(温度系数):X7R;; LCSC Part Name: 3.3nF ±10% 50V; Supplier Part: C92203; Manufacturer: FH(风华); Supplier Footprint: 0603; JLCPCB Part Class: Extended Part; Datasheet: https://atta.szlcsc.com/upload/public/pdf/source/20200305/C486355_26A10D38EF8C2A5C37091D0039909270.pdf; Supplier: LCSC; Tolerance: ±10%; Voltage Rated: 50V; Temperature Coefficient: X7R
C48 = 0603B512K500NT: 容值:5.1nF;精度:±10%;额定电压:50V;材质(温度系数):X7R;; LCSC Part Name: 5.1nF ±10% 50V; Supplier Part: C1587; Manufacturer: FH(风华); Supplier Footprint: 0603; JLCPCB Part Class: Extended Part; Datasheet: https://atta.szlcsc.com/upload/public/pdf/source/20200305/C486355_26A10D38EF8C2A5C37091D0039909270.pdf; Supplier: LCSC; Tolerance: ±10%; Voltage Rated: 50V; Temperature Coefficient: X7R
C52-C54 C75-C77 = 0603B403K500NT: 容值:40nF;精度:±10%;额定电压:50V;材质(温度系数):X7R;; LCSC Part Name: 40nF ±10% 50V; Supplier Part: C41782; Manufacturer: FH(风华); Supplier Footprint: 0603; JLCPCB Part Class: Extended Part; Datasheet: https://atta.szlcsc.com/upload/public/pdf/source/20200305/C486355_26A10D38EF8C2A5C37091D0039909270.pdf; Supplier: LCSC; Tolerance: ±10%; Voltage Rated: 50V; Temperature Coefficient: X7R
C67 C88 = CL10A475KL8NRNC: 容值:4.7uF;精度:±10%;额定电压:35V;材质(温度系数):X5R;; LCSC Part Name: 4.7uF ±10% 35V; Supplier Part: C307467; Manufacturer: SAMSUNG(三星); Supplier Footprint: 0603; JLCPCB Part Class: Extended Part; Datasheet: https://atta.szlcsc.com/upload/public/pdf/source/20160218/1457707763339.pdf; Supplier: LCSC; Tolerance: ±10%; Voltage Rated: 35V; Temperature Coefficient: X5R
C68 = 0603B682K500NT: 容值:6.8nF;精度:±10%;额定电压:50V;材质(温度系数):X7R;; LCSC Part Name: 6.8nF ±10% 50V; Supplier Part: C1631; Manufacturer: FH(风华); Supplier Footprint: 0603; JLCPCB Part Class: Basic Part; Datasheet: https://atta.szlcsc.com/upload/public/pdf/source/20200305/C486355_26A10D38EF8C2A5C37091D0039909270.pdf; Supplier: LCSC; Tolerance: ±10%; Voltage Rated: 50V; Temperature Coefficient: X7R
C71 = CC0603KRX7R9BB472: 容值:4.7nF;精度:±10%;额定电压:50V;材质(温度系数):X7R;; LCSC Part Name: 4.7nF ±10% 50V; Supplier Part: C106218; Manufacturer: YAGEO(国巨); Supplier Footprint: 0603; JLCPCB Part Class: Extended Part; Datasheet: https://atta.szlcsc.com/upload/public/pdf/source/20180910/C282072_33301C7F631E79921B82A8DAC6BCC5B3.pdf; Supplier: LCSC; Tolerance: ±10%; Voltage Rated: 50V; Temperature Coefficient: X7R
CN4 CN5 = M1010RS-05P: 插针结构:1x5P;间距:1mm;安装方式:卧贴;参考系列:-;总PIN数:5P;排数:1;每排PIN数:5;行距:-;额定电流:1A;工作温度范围:-25℃~+85℃;; LCSC Part Name: 1x5P 间距:1mm 卧贴; Supplier Part: C541847; Manufacturer: XFCN(兴飞); Supplier Footprint: SMD,P=1mm,卧贴; JLCPCB Part Class: Extended Part; Datasheet: https://atta.szlcsc.com/upload/public/pdf/source/20200518/C541847_4FBBB7CE1CCFE042AF6DD43CBAA42E89.pdf; Supplier: LCSC; Pins Structure: 1x5P; Pitch: 1mm; Mounting Style: 卧贴; Number of Pins: 5P; Number of Rows: 1; Number of PINs Per Row: 5; Current Rating (Max): 1A; Operating Temperature Range: -25℃~+85℃
H5 H6 = MR30-M: Supplier Part: C99873; Supplier: LCSC; Manufacturer: AMASS(艾迈斯)
L1 = FNR6045S121MT: 电感值:120uH;精度:±20%;额定电流:850mA;饱和电流(Isat):940mA;; LCSC Part Name: 120uH ±20% 940mA; Supplier Part: C168096; Manufacturer: cjiang(长江微电); Supplier Footprint: SMD,6x6mm; JLCPCB Part Class: Extended Part; Datasheet: https://atta.szlcsc.com/upload/public/pdf/source/20190327/C167925_9EFF0AABC4CA629C2CC95961DBF7D39D.pdf; Supplier: LCSC; Tolerance: ±20%; Rated Current: 850mA; Saturation Current (Isat): 940mA; DC Resistance (DCR): 629mΩ
L2 = SWPA6028S220MT: 电感值:22uH;精度:±20%;额定电流:1.4A;饱和电流(Isat):1.45A;类型:-;; LCSC Part Name: 22uH ±20% 1.45A; Supplier Part: C51349; Manufacturer: Sunlord(顺络); Supplier Footprint: SMD; JLCPCB Part Class: Extended Part; Datasheet: https://atta.szlcsc.com/upload/public/pdf/source/20231024/317626D2AA2F8AB4113C1875E432E6E1.pdf; Supplier: LCSC; Tolerance: ±20%; Rated Current: 1.4A; Saturation Current (Isat): 1.45A; DC Resistance (DCR): 140mΩ
Q2-Q13 = KNY3406C: 类型:1个N沟道;漏源电压(Vdss):60V;连续漏极电流(Id):80A;导通电阻(RDS(on)@Vgs,Id):7mΩ@10V,10A;功率:41W;阈值电压(Vgs(th)@Id):1.3V@250uA;; LCSC Part Name: 1个N沟道 耐压:60V 电流:80A; Supplier Part: C455987; Manufacturer: KIA; Supplier Footprint: PDFN-8(5.8x4.9); JLCPCB Part Class: Extended Part; Datasheet: https://atta.szlcsc.com/upload/public/pdf/source/20191114/C455987_5B27682C33C31BB0F5A9BF4BAD1962A9.pdf; Supplier: LCSC; Type: 1个N沟道; Drain Source Voltage (Vdss): 60V; Continuous Drain Current (Id): 80A; Drain Source On Resistance (RDS(on)@Vgs,Id): 7mΩ@10V,10A; Power Dissipation (Pd): 41W; Gate Threshold Voltage (Vgs(th)@Id): 1.3V@250uA; Total Gate Charge (Qg@Vgs): 55nC@10V; Input Capacitance (Ciss@Vds): 3.3nF; Reverse Transfer Capacitance (Crss@Vds): 150pF@30V; Operating Temperature: -55℃~+150℃
R22 = TC0325D5623T5E: 电阻类型:薄膜电阻;阻值:562kΩ;精度:±0.5%;功率:166.667mW;最大工作电压:75V;温度系数:±25ppm/℃;; LCSC Part Name: 562kΩ ±0.5% 166.667mW 薄膜电阻; Supplier Part: C51262; Manufacturer: UNI-ROYAL(厚声); Supplier Footprint: 0603; JLCPCB Part Class: Extended Part; Datasheet: https://atta.szlcsc.com/upload/public/pdf/source/20190904/C425668_F2F639A313B6F33D501F342892FD5229.pdf; Supplier: LCSC; Type: 薄膜电阻; Tolerance: ±0.5%; Power(Watts): 166.667mW; Overload Voltage (Max): 75V; Temperature Coefficient: ±25ppm/℃; Operating Temperature Range: -55℃~+155℃
R23 = RC0603FR-07140KL: 电阻类型:厚膜电阻;阻值:140kΩ;精度:±1%;功率:100mW;最大工作电压:75V;温度系数:±100ppm/℃;; LCSC Part Name: 厚膜电阻 140kΩ ±1% 100mW; Supplier Part: C185372; Manufacturer: YAGEO(国巨); Supplier Footprint: 0603; JLCPCB Part Class: Extended Part; Datasheet: https://atta.szlcsc.com/upload/public/pdf/source/20180904/C276339_014E484F1DBA106FB92D45EABD5A1AC1.pdf; Supplier: LCSC; Type: 厚膜电阻; Tolerance: ±1%; Power(Watts): 100mW; Overload Voltage (Max): 75V; Temperature Coefficient: ±100ppm/℃; Operating Temperature Range: -55℃~+155℃
R27 = AC0603FR-07133KL: 电阻类型:厚膜电阻;阻值:133kΩ;精度:±1%;功率:100mW;最大工作电压:75V;温度系数:±100ppm/℃;; LCSC Part Name: 厚膜电阻 133kΩ ±1% 100mW; Supplier Part: C227577; Manufacturer: YAGEO(国巨); Supplier Footprint: 0603; JLCPCB Part Class: Extended Part; Datasheet: https://atta.szlcsc.com/upload/public/pdf/source/20180927/C229861_4ABDC471507C1ED6AFB4BA66AFC8620A.pdf; Supplier: LCSC; Type: 厚膜电阻; Tolerance: ±1%; Power(Watts): 100mW; Overload Voltage (Max): 75V; Temperature Coefficient: ±100ppm/℃; Operating Temperature Range: -55℃~+155℃
R29-R31 R33-R35 R49-R51 R53-R55 = 0603WAJ022JT5E: 电阻类型:厚膜电阻;阻值:2.2Ω;精度:±5%;功率:100mW;最大工作电压:75V;温度系数:±200ppm/℃;; LCSC Part Name: 2.2Ω ±5% 100mW 厚膜电阻; Supplier Part: C25226; Manufacturer: UNI-ROYAL(厚声); Supplier Footprint: 0603; JLCPCB Part Class: Extended Part; Datasheet: https://atta.szlcsc.com/upload/public/pdf/source/20200306/C422600_1E6D84923E4A46A82E41ADD87F860B5C.pdf; Supplier: LCSC; Type: 厚膜电阻; Tolerance: ±5%; Power(Watts): 100mW; Overload Voltage (Max): 75V; Temperature Coefficient: ±200ppm/℃; Operating Temperature Range: -55℃~+155℃
R32 R48 = ARG03FTC1802: 电阻类型:薄膜电阻;阻值:18kΩ;精度:±1%;功率:100mW;最大工作电压:75V;温度系数:±25ppm/℃;; LCSC Part Name: 薄膜电阻 18kΩ ±1% 100mW; Supplier Part: C217831; Manufacturer: Viking(光颉); Supplier Footprint: 0603; JLCPCB Part Class: Extended Part; Datasheet: https://atta.szlcsc.com/upload/public/pdf/source/20200117/C485675_99063924B4564AF910B7BE66DA8EFA49.pdf; Supplier: LCSC; Type: 薄膜电阻; Tolerance: ±1%; Power(Watts): 100mW; Overload Voltage (Max): 75V; Temperature Coefficient: ±25ppm/℃; Operating Temperature Range: -55℃~+155℃
R36 R37 R58 R59 = LRAN25GFER0005S: 电阻类型:采样电阻;阻值:0.5mΩ;精度:±1%;功率:3W;; LCSC Part Name: 0.5mΩ ±1% 3W; Supplier Part: C5121028; Manufacturer: NCT(利昇达); Supplier Footprint: 2512; JLCPCB Part Class: Extended Part; Datasheet: https://atta.szlcsc.com/upload/public/pdf/source/20220802/2693C2EE618FE3489E564C832611E315.pdf; Supplier: LCSC; Type: 采样电阻; Tolerance: ±1%; Power(Watts): 3W
R41 = RC0603FR-07365KL: 电阻类型:厚膜电阻;阻值:365kΩ;精度:±1%;功率:100mW;最大工作电压:75V;温度系数:±100ppm/℃;; LCSC Part Name: 厚膜电阻 365kΩ ±1% 100mW; Supplier Part: C185336; Manufacturer: YAGEO(国巨); Supplier Footprint: 0603; JLCPCB Part Class: Extended Part; Datasheet: https://atta.szlcsc.com/upload/public/pdf/source/20180904/C276339_014E484F1DBA106FB92D45EABD5A1AC1.pdf; Supplier: LCSC; Type: 厚膜电阻; Tolerance: ±1%; Power(Watts): 100mW; Overload Voltage (Max): 75V; Temperature Coefficient: ±100ppm/℃; Operating Temperature Range: -55℃~+155℃
R42 = RMC 0603 52K3 F N: 阻值:52.3kΩ;精度:±1%;功率:100mW;; LCSC Part Name: 52.3kΩ ±1% 100mW; Supplier Part: C325624; Manufacturer: Tyohm(幸亚电阻); Supplier Footprint: 0603; JLCPCB Part Class: Extended Part; Datasheet: https://atta.szlcsc.com/upload/public/pdf/source/20190115/C325956_D27151D492FFB3C9AB4A6F14FE01F30A.pdf; Supplier: LCSC; Tolerance: ±1%; Power(Watts): 100mW
R43 = RM06FTN8662: 电阻类型:厚膜电阻;阻值:86.6kΩ;精度:±1%;功率:100mW;最大工作电压:75V;温度系数:±100ppm/℃;; LCSC Part Name: 厚膜电阻 86.6kΩ ±1% 100mW; Supplier Part: C188033; Manufacturer: 大毅科技; Supplier Footprint: 0603; JLCPCB Part Class: Extended Part; Datasheet: https://atta.szlcsc.com/upload/public/pdf/source/20180912/C193177_4BB6657F58E460C8C6C7C234EECF646B.pdf; Supplier: LCSC; Type: 厚膜电阻; Tolerance: ±1%; Power(Watts): 100mW; Overload Voltage (Max): 75V; Temperature Coefficient: ±100ppm/℃; Operating Temperature Range: -55℃~+155℃
RN1 RN2 = RC-ML08W101JT: 电阻器数:4;阻值:100Ω;精度:±5%;单个元件功率:62.5mW;温度系数:±100ppm/℃;; LCSC Part Name: 100Ω ±5%; Supplier Part: C79203; Manufacturer: FH(风华); Supplier Footprint: 0603x4; JLCPCB Part Class: Extended Part; Datasheet: https://atta.szlcsc.com/upload/public/pdf/source/20140224/1457706855019.pdf; Supplier: LCSC; Number of Resistors: 4; Tolerance: ±5%; Power(Watts): 62.5mW; Temperature Coefficient: ±100ppm/℃; Number of Pins: 8
RT1 RT2 = NCP18XH103F03RB: 阻值(25℃):10kΩ;B值(25℃/50℃):3380K;电阻精度:±1%;功率:100mW;B值精度:±1%;最大稳态电流(25℃):310uA;; LCSC Part Name: 10kΩ 电阻精度:±1% 3380K; Supplier Part: C13564; Manufacturer: muRata(村田); Supplier Footprint: 0603; JLCPCB Part Class: Extended Part; Datasheet: https://atta.szlcsc.com/upload/public/pdf/source/20130819/1457706638081.pdf; Supplier: LCSC; Resistance @ 25℃: 10kΩ; B Constant (25℃/50℃): 3380K; Resistance Tolerance: ±1%; B Constant (25℃/85℃): 3434K; B Constant (25℃/100℃): 3455K; Power: 100mW; B Constant Tolerance: ±1%; Steady State Current (Max): 310uA; Operating Temperature: -40℃~+125℃
U8 U9 = DRV8301DCAR: DRV8301 具有降压稳压器、电流分流放大器和 SPI 的最大 65V 三相栅极驱动器; LCSC Part Name: 无刷直流BLDC电机驱动芯片 60V; Supplier Part: C98969; Manufacturer: TI(德州仪器); Supplier Footprint: HTSSOP-56-6mm; JLCPCB Part Class: Extended Part; Datasheet: https://www.ti.com/cn/lit/gpn/drv8301; Supplier: LCSC; JLCPCB SMD: Yes

## Nets
5V: C37.2 C39.2 C40.2 C70.2 D1.1(K) L2.2 P1.2(5V) P1.4(5V) R42.1 TP5.1 U5.1(VIN) U5.3(EN) U6.1(IN) U6.3(EN) U7.2 U7.5 U7.8 U7.10
12V: C47.2 L1.2 PIN1.1 R23.1 TP6.1
AVCC: C7.2 C38.2 PIN6.1 RT1.2 RT2.2 TP4.1 U6.5(OUT) U8.24(REF) U9.24(REF) U10.21(VREF+) U10.22(VDDA)
GND: C1.2 C2.1 C3.1 C4.2 C5.1 C6.1 C7.1 C8.2 C9.2 C10.1 C11.1 C12.1 C13.1 C14.1 C15.1 C16.1 C17.2 C18.1 C19.2 C20.1 C21.1 C22.2 C23.2 C24.2 C36.2 C37.1 C38.1 C39.1 C40.1 C41.1 C42.1 C43.1 C44.1 C45.1 C47.1 C48.1 C52.1 C53.1 C54.1 C55.1 C59.2 C60.1 C62.1 C63.1 C65.1 C69.1 C70.1 C71.1 C75.1 C76.1 C77.1 C80.1 C83.2 C85.1 C86.1 C87.1 C90.1 CN1.6 CN1.7 CN1.8 CN3.6 CN3.7 CN3.8 CN4.5 CN5.5 CN7.6 CN7.7 CN7.8 D3.2(A) D4.2(A) H1.4 H2.2 LED1.2 P1.6(GND) P1.9(GND) P1.14(GND) P1.20(GND) P1.25(GND) P1.30(GND) P1.34(GND) P1.39(GND) P2.6(GND) P2.9(GND) P2.14(GND) P2.20(GND) P2.25(GND) P2.30(GND) P2.34(GND) P2.39(GND) PIN5.1 Q1.2(E) R7.2 R14.2 R21.2 R22.2 R28.2 R32.2 R38.2 R41.2 R44.2 R48.2 R57.2 SW1.1 SW2.7(EP) SW2.8(EP) TFT1.8(GND) TFT1.13(GND) U1.3(GND) U1.11(EP) U2.2(GND) U3.4(GND) U4.1(CLKIN) U4.9(AD0) U4.11(FSYNC) U4.18(GND) U5.2(GND) U6.2(GND) U7.1 U7.4 U7.7 U7.11 U7.15 U7.16 U8.28(AGND) U8.57(EP) U9.28(AGND) U9.57(EP) U10.10(VSS) U10.20(VSSA) U10.27(VSS) U10.74(VSS) U10.99(VSS) USBC1.0 USBC1.A1(GND) USBC1.A12(GND) USBC1.B1(GND) USBC1.B12(GND) X1.2(VSS)
PGND: C26.2 C27.2 C28.2 C29.2 C30.2 C31.2 C32.2 C33.2 C34.2 C35.2 C46.1 C49.1 C66.1 C67.1 C68.1 C72.1 C88.1 C89.1 D2.2 H3.1 Q5.1(S) Q5.2(S) Q5.3(S) Q13.1(S) Q13.2(S) Q13.3(S) R19.1 R21.1 R36.1 R37.1 R58.1 R59.1 RN1.1 RN1.3 RN2.1 RN2.3 U8.44(SL-A) U9.44(SL-A)
VBUS_S: C6.2 R4.2 R7.1 U10.31(PA6)
VCC: C2.2 C3.2 C10.2 C11.2 C12.2 C13.2 C14.2 C15.2 C16.2 C18.2 C36.1 C42.2 C43.2 CN1.1 CN3.1 CN4.1 CN5.1 CN7.1 H1.1 H2.1 R3.1 R5.2 R16.2 R17.2 R24.1 R25.1 R26.1 R45.1 R46.1 R47.1 SW2.5(COM) TFT1.10(VCC) TFT1.12(VCC) TP3.1 U1.7(VCC) U1.10(V3) U2.3(VCC) U3.3(/WP) U3.7(/HOLD) U3.8(VCC) U4.8(VLOGIC) U4.13(VDD) U5.5(VOUT) U8.49(VDD-SPI) U9.49(VDD-SPI) U10.6(VBAT) U10.11(VDD) U10.19(VDD) U10.28(VDD) U10.50(VDD) U10.75(VDD) U10.100(VDD)
_GPIO_0: P1.10(RXD/PA10) R1.1
_GPIO_1: P1.8(TXD/PA9) R2.1
_GPIO_2: P1.12(PCM_SCLK/PI5) R9.1 U7.3
_GPIO_3: P1.16(GPIOH_14/PH14) R10.1 U7.6
_GPIO_4: CN3.2 P1.18(GPIOC_7/PC7) R11.1
_GPIO_5: CN1.2 P1.7(PA8) R13.1
_GPIO_6: P1.22(GPIOC_6/PC6) R15.1 U7.9
_GPIO_7: P1.24(NSS/PI0) R18.1 U7.12
_USB_DM: R8.2 USBC1.B7(DN2)
_USB_DP: R6.2 USBC1.B6(DP2)
AUX_H: PIN4.1 U10.48(PB11)
AUX_L: PIN3.1 U10.47(PB10)
AUX_TEMP: PIN2.1 U10.30(PA5)
BOOT0: R14.1 U10.94(BOOT0)
CAN_D: U2.1(D) U10.96(PB9)
CAN_H: R12.1 U2.7(CANH) U7.14
CAN_L: R12.2 U2.6(CANL) U7.13
CAN_R: U2.4(R) U10.95(PB8)
DCBUS: C25.2 C26.1 C27.1 C28.1 C29.1 C30.1 C31.1 C32.1 C33.1 C34.1 C35.1 C49.2 C66.2 C67.2 C72.2 C88.2 C89.2 D2.1 H3.2 Q2.5(D) Q2.6(D) Q2.7(D) Q2.8(D) Q3.5(D) Q3.6(D) Q3.7(D) Q3.8(D) Q4.5(D) Q4.6(D) Q4.7(D) Q4.8(D) Q8.5(D) Q8.6(D) Q8.7(D) Q8.8(D) Q9.5(D) Q9.6(D) Q9.7(D) Q9.8(D) Q10.5(D) Q10.6(D) Q10.7(D) Q10.8(D) R4.1 U8.29(PVDD1) U8.53(PVDD2) U8.54(PVDD2) U9.29(PVDD1) U9.53(PVDD2) U9.54(PVDD2)
EN_GATE: TP1.1 U8.16(EN-GATE) U9.16(EN-GATE) U10.51(PB12)
FLASH_NCS: U3.1(/CS) U10.38(PE7)
FREEIO_1: P2.19(PC5_ETH_RXD1) U10.84(PD3)
FREEIO_2: P2.18(ETH_RXD0/PC4) U10.85(PD4)
FREEIO_5: P2.8(ETH_TXD1/PG14) U10.88(PD7)
FREEIO_6: P2.5(PG13/ETH_TXD0) U10.97(PE0)
FREEIO_7: P2.3(PG11/ETH_TX_EN) U10.98(PE1)
FREEIO_8: P2.24(ETH_MDIO/PA2) U10.81(PD0)
FREEIO_9: P2.22(ETH_REF_CLK/PA1) U10.82(PD1)
FREEIO_10: P1.28(GPIOH_8/PH8) U10.55(PD8)
FREEIO_11: P1.23(PI1/SCLK) U10.56(PD9)
FREEIO_12: P1.26(GPIOG_7/PG7) U10.57(PD10)
FREEIO_13: P1.21(PI2/MISO) U10.58(PD11)
FREEIO_14: P1.19(PI3/MOSI) U10.59(PD12)
GPIO_0: C1.1 R1.2 U1.9(RXD) U10.23(PA0-WKUP(PA0))
GPIO_1: C4.1 R2.2 U1.8(TXD) U10.24(PA1)
GPIO_2: C8.1 R9.2 U10.25(PA2)
GPIO_3: C9.1 R10.2 U10.26(PA3)
GPIO_4: C17.1 R11.2 U10.33(PC4)
GPIO_5: C19.1 R13.2 U10.37(PB2-BOOT1(PB2))
GPIO_6: C22.1 R15.2 U10.77(PA15(JTDI))
GPIO_7: C24.1 R18.2 U10.89(PB3(JTDOTRACESWO))
GPIO_8: CN7.5 U10.86(PD5)
GPIO_9: CN7.4 U10.87(PD6)
GVDD: C55.2 U8.13(GVDD)
GVDD2: C80.2 U9.13(GVDD)
I2C_SCL: H2.3 R17.1 U4.23(SCL) U10.60(PD13)
I2C_SDA: H2.4 R16.1 U4.24(SDA) U10.61(PD14)
M0_AH: U8.17(INH-A) U10.67(PA8)
M0_AL: U8.18(INL-A) U10.52(PB13)
M0_BH: U8.19(INH-B) U10.68(PA9)
M0_BL: U8.20(INL-B) U10.53(PB14)
M0_CH: U8.21(INH-C) U10.69(PA10)
M0_CL: U8.22(INL-C) U10.54(PB15)
M0_ENC_A: C54.2 CN4.2 R26.2 U10.90(PB4(NJTRST))
M0_ENC_B: C53.2 CN4.3 R25.2 U10.91(PB5)
M0_ENC_Z: C52.2 CN4.4 R24.2 U10.66(PC9)
M0_GH_A: R29.2 U8.47(GH-A)
M0_GH_B: R30.2 U8.42(GH-B)
M0_GH_C: R31.2 U8.37(GH-C)
M0_GL_A: R33.2 U8.45(GL-A)
M0_GL_B: R34.2 U8.40(GL-B)
M0_GL_C: R35.2 U8.35(GL-C)
M0_NCS: U8.8(NSCS) U10.7(PC13)
M0_SH_A: C51.2 H5.1 Q2.1(S) Q2.2(S) Q2.3(S) Q5.5(D) Q5.6(D) Q5.7(D) Q5.8(D) U8.46(SH-A)
M0_SH_B: C57.2 H5.2 Q3.1(S) Q3.2(S) Q3.3(S) Q6.5(D) Q6.6(D) Q6.7(D) Q6.8(D) U8.41(SH-B)
M0_SH_C: C58.2 H5.3 Q4.1(S) Q4.2(S) Q4.3(S) Q7.5(D) Q7.6(D) Q7.7(D) Q7.8(D) U8.36(SH-C)
M0_SL_B: Q6.1(S) Q6.2(S) Q6.3(S) R36.2 RN1.4 U8.39(SL-B)
M0_SL_C: Q7.1(S) Q7.2(S) Q7.3(S) R37.2 RN1.2 U8.34(SL-C)
M0_SO1: C62.2 R39.2 U10.15(PC0)
M0_SO2: C63.2 R40.2 U10.16(PC1)
M0_TEMP: C60.2 R38.1 RT1.1 U10.34(PC5)
M1_AH: U9.17(INH-A) U10.63(PC6)
M1_AL: U9.18(INL-A) U10.32(PA7)
M1_BH: U9.19(INH-B) U10.64(PC7)
M1_BL: U9.20(INL-B) U10.35(PB0)
M1_CH: U9.21(INH-C) U10.65(PC8)
M1_CL: U9.22(INL-C) U10.36(PB1)
M1_ENC_A: C75.2 CN5.2 R45.2 U10.92(PB6)
M1_ENC_B: C76.2 CN5.3 R46.2 U10.93(PB7)
M1_ENC_Z: C77.2 CN5.4 R47.2 U10.9(PC15-OSC32_OUT(PC15))
M1_GH_A: R51.2 U9.47(GH-A)
M1_GH_B: R50.2 U9.42(GH-B)
M1_GH_C: R49.2 U9.37(GH-C)
M1_GL_A: R55.2 U9.45(GL-A)
M1_GL_B: R54.2 U9.40(GL-B)
M1_GL_C: R53.2 U9.35(GL-C)
M1_NCS: U9.8(NSCS) U10.8(PC14-OSC32_IN(PC14))
M1_SH_A: C74.1 H6.1 Q10.1(S) Q10.2(S) Q10.3(S) Q13.5(D) Q13.6(D) Q13.7(D) Q13.8(D) U9.46(SH-A)
M1_SH_B: C78.1 H6.2 Q9.1(S) Q9.2(S) Q9.3(S) Q12.5(D) Q12.6(D) Q12.7(D) Q12.8(D) U9.41(SH-B)
M1_SH_C: C81.1 H6.3 Q8.1(S) Q8.2(S) Q8.3(S) Q11.5(D) Q11.6(D) Q11.7(D) Q11.8(D) U9.36(SH-C)
M1_SL_B: Q12.1(S) Q12.2(S) Q12.3(S) R59.2 RN2.4 U9.39(SL-B)
M1_SL_C: Q11.1(S) Q11.2(S) Q11.3(S) R58.2 RN2.2 U9.34(SL-C)
M1_SO1: C87.2 R52.2 U10.18(PC3)
M1_SO2: C86.2 R56.2 U10.17(PC2)
M1_TEMP: C85.2 R57.1 RT2.1 U10.29(PA4)
MPU_INT: U4.12(INT) U10.62(PD15)
NFAULT: TP2.1 U8.6(NFAULT) U9.6(NFAULT) U10.83(PD2)
NRST: C5.2 P1.11(PA15/GPIOA_15) R3.2 SW1.2 U10.14(NRST)
OSC_IN: U10.12(PH0-OSC_IN(PH0)) X1.1
OSC_OUT: U10.13(PH1-OSC_OUT(PH1)) X1.3
SPI_MISO: CN1.4 CN3.4 U3.2(DO) U8.10(SDO) U9.10(SDO) U10.79(PC11)
SPI_MOSI: CN1.5 CN3.5 U3.5(DI) U8.9(SDI) U9.9(SDI) U10.80(PC12)
SPI_SCK: CN1.3 CN3.3 U3.6(CLK) U8.11(SCLK) U9.11(SCLK) U10.78(PC10)
SRC_BL: Q1.1(B) U10.46(PE15)
SRC_CS: TFT1.7(CS) U10.42(PE11)
SRC_DC: TFT1.5(DC) U10.40(PE9)
SRC_RES: TFT1.6(RES) U10.41(PE10)
SRC_SCL: TFT1.4(SCL) U10.43(PE12)
SRC_SDA: TFT1.3(SDA) U10.45(PE14)
SW_D: SW2.3(C) U10.1(PE2)
SW_KEY: SW2.2(KEY) U10.5(PE6)
SW_L: SW2.1(A) U10.4(PE5)
SW_R: SW2.6(D) U10.2(PE3)
SW_U: SW2.4(B) U10.3(PE4)
SWCLK: CN7.2 H1.3 U10.76(PA14(JTCK-SWCLK))
SWDIO: CN7.3 H1.2 U10.72(PA13(JTMS-SWDIO))
USB_DM: R8.1 U10.70(PA11)
USB_DP: R6.1 U10.71(PA12)
VUSB: F1.2 USBC1.A4(VBUS) USBC1.A9(VBUS) USBC1.B4(VBUS) USBC1.B9(VBUS)
$3N8656: Q2.4(G) R29.1
$3N8657: Q5.4(G) R33.1
$3N8669: Q6.4(G) R34.1
$3N8670: Q3.4(G) R30.1
$3N8677: Q7.4(G) R35.1
$3N8678: Q4.4(G) R31.1
$3N8709: C58.1 U8.38(BST-C)
$3N8710: C61.2 RN1.5 U8.33(SN1)
$3N8711: C64.1 RN1.7 U8.31(SN2)
$3N8712: C64.2 RN1.8 U8.30(SP2)
$3N8715: C65.2 U8.27(AVDD)
$3N8716: R39.1 U8.25(SO1)
$3N8717: R40.1 U8.26(SO2)
$3N8724: C59.1 U8.23(DVDD)
$3N8739: C56.2 U8.15(CP2)
$3N8740: C56.1 U8.14(CP1)
$3N8750: R32.1 U8.7(DTC)
$3N8752: R23.2 R28.1 U8.3(VSENSE)
$3N8756: R22.1 U8.1(RT-CLK)
$3N8759: C50.1 U8.52(BST-BK)
$3N8772: C61.1 RN1.6 U8.32(SP1)
$3N8786: C48.2 R27.2
$3N8810: C45.2 R27.1 U8.2(COMP)
$3N8812: C57.1 U8.43(BST-B)
$3N8813: C51.1 U8.48(BST-A)
$3N8818: C46.2 U8.56(SS-TR)
$3N8819: C50.2 D3.1(K) L1.1 U8.50(PH) U8.51(PH)
$3N8853: C82.2 RN2.5 U9.33(SN1)
$3N8854: C84.1 RN2.7 U9.31(SN2)
$3N8859: C90.2 U9.27(AVDD)
$3N8860: R52.1 U9.25(SO1)
$3N8861: R56.1 U9.26(SO2)
$3N8873: C79.1 U9.14(CP1)
$3N8883: R48.1 U9.7(DTC)
$3N8885: R42.2 R44.1 U9.3(VSENSE)
$3N8889: R41.1 U9.1(RT-CLK)
$3N8892: C73.1 U9.52(BST-BK)
$3N8899: C68.2 U9.56(SS-TR)
$3N8902: C84.2 RN2.8 U9.30(SP2)
$3N8903: C82.1 RN2.6 U9.32(SP1)
$3N8919: C71.2 R43.2
$3N8956: Q8.4(G) R49.1
$3N8957: Q11.4(G) R53.1
$3N8964: Q9.4(G) R50.1
$3N8965: Q12.4(G) R54.1
$3N8977: Q13.4(G) R55.1
$3N8978: Q10.4(G) R51.1
$3N8987: C69.2 R43.1 U9.2(COMP)
$3N8998: C83.1 U9.23(DVDD)
$3N8999: C79.2 U9.15(CP2)
$3N9000: C81.2 U9.38(BST-C)
$3N9001: C78.2 U9.43(BST-B)
$3N9002: C74.2 U9.48(BST-A)
$3N9003: C73.2 D4.1(K) L2.1 U9.50(PH) U9.51(PH)
$4N14784: R20.2 TFT1.11(LEDK)
$4N14815: LED1.1 R5.1
$4N14817: C20.2 U10.73(VCAP_2)
$4N14818: C21.2 U10.49(VCAP_1)
$4N15129: Q1.3(C) R20.1
$4N15154: C25.1 R19.2
$4N15175: U1.2(UD-) USBC1.A7(DN1)
$4N15176: U1.1(UD+) USBC1.A6(DP1)
$4N15201: D1.2(A) F1.1
$4N15202: C41.2 U5.4(BP)
$4N15207: C44.2 U4.10(REGOUT)
$4N15216: C23.1 U4.20(CPOUT)

Not connected (* = marked no-connect by the designer): CN4 6* 7*; CN5 6* 7*; P1 1(3V3)* 3(PH12/SDA.1)* 5(PH11/SCL.1)* 13(PH15/GPIOH_15)* 15(PH13/GPIOH_13)* 17(3V3)* 27(PD13/GPIOD_13)* 29(PH7)* 31(PH9)* 32(GPIOH_10/PH10)* 33(PB13/FDCAN2_TX)* 35(PI7/PCM_FS)* 36(FDCAN2_RX/PB12)* 37(PI4/PCM_MCLK)* 38(PCM_IN/PG10)* 40(PCM_OUT/PI6)*; P2 1(3V3)* 2(3V_BAT)* 4(V_REF+)* 7(PB9_FDCAN1_TX)* 10(FDCAN1_RX/PB8)* 11(PC2_C/ADC_C2)* 12(ETH_MDC/PC1)* 13(PC3_C/ADC_C3)* 15(PA0_C/ADC_A0)* 16(ADC_A1/PA1_C)* 17(3V3)* 21(PA7/ETH_CRS_DV)* 23(PA6/GPIOA_6)* 26(ETH_RESET/PA3)* 27(PA12/USB_OTG_P)* 28(USB_OTG_N/PA11)* 29(PE4/SPI4_NSS)* 31(PE5/SPI4_MISO)* 32(SPI4_SCK/PE2)* 33(PE6/SPI4_MOSI)* 35(PH2/GPIOH_2)* 36(GPIOH_3/PH3)* 37(PB1/GPIOB_1)* 38(GPIOB_0/PB0)* 40(GPIOB_2/PB2)*; TFT1 1(NC)* 2(NC)* 9(NC)*; U1 4(DTR#)* 5(CTS#)* 6(RTS#)*; U2 5(NC)* 8(NC)*; U4 2(NC)* 3(NC)* 4(NC)* 5(NC)* 6(AX_DA)* 7(AX_CL)* 14(NC)* 15(NC)* 16(NC)* 17(NC)* 19(RESV)* 21(RESV)* 22(CLKOUT)*; U6 4(N/C)*; U8 4(PWRGD)* 5(NOCTW)* 12(DC-CAL)* 55(EN-BUCK)*; U9 4(PWRGD)* 5(NOCTW)* 12(DC-CAL)* 55(EN-BUCK)*; U10 39(PE8)* 44(PE13)*; USBC1 A5(CC1)* A8(SBU1)* B5(CC2)* B8(SBU2)*

## Notes on the sheets
sheet 1
- HALL传感器
- Motor0
- R
- DTC
- Dead Time (ns) =
- 150k
- 450 + 50
- HALL传感器
- Motor1
sheet 2
- Minimal System
- Type C
- Voltage Sampling
- Alternative Chips:
  STM32F405VGT6
  STM32F407VGT6
  STM32F415VGT6
  STM32F417VGT6
- Reset Circuit
- Power Indicator
- Five-way switch
- Right  右
- UP 上
- Down 下
- center 中
- CAN Transceiver
- SPI FLASH
- Left 左
- MPU6050
- Power
- Filter Circuits
- 1.14' IPS屏幕
- AUX & CAN
- Interface Description
- Interface
- GPIO
- Primary
- Step/Dir
- Analog/PWM
- This Project
- GPIO0
- UART TX
- Axis 0 Step
- Analog/PWM
- TX1
- GPIO1
- UART RX
- Axis 0 Dir
- Analog/PWM
- RX2
- TIM_CH1
- GPIO2
- Analog/PWM
- Analog/PWM/Axis 1 Step
- GPIO3
- Analog/PWM
- Analog/PWM/Axis 0 Step
- TIM_CH2N
- Analog
- SPI CS0
- GPIO4
- GPIO5
- SPI CS1
- GPIO6
- Axis 1 Step
- Axis 1 Dir
- GPIO7
- Axis 1 Dir
- Axis 0 Dir
- GPIO8
- Axis 1 Step
- Axis 1 Dir
- GPIO9
- Axis 1 Dir
- Axis 0 Dir
- Extended Interface
- Testpoint
- LOGO
